# EasyEDA schematic SCH_Beekeeper_2024-03-11.json
TITLE: Beekeeper; REV: 0.3; Date: 2024-01-10; Sheet: 1/1; Company: Your Company
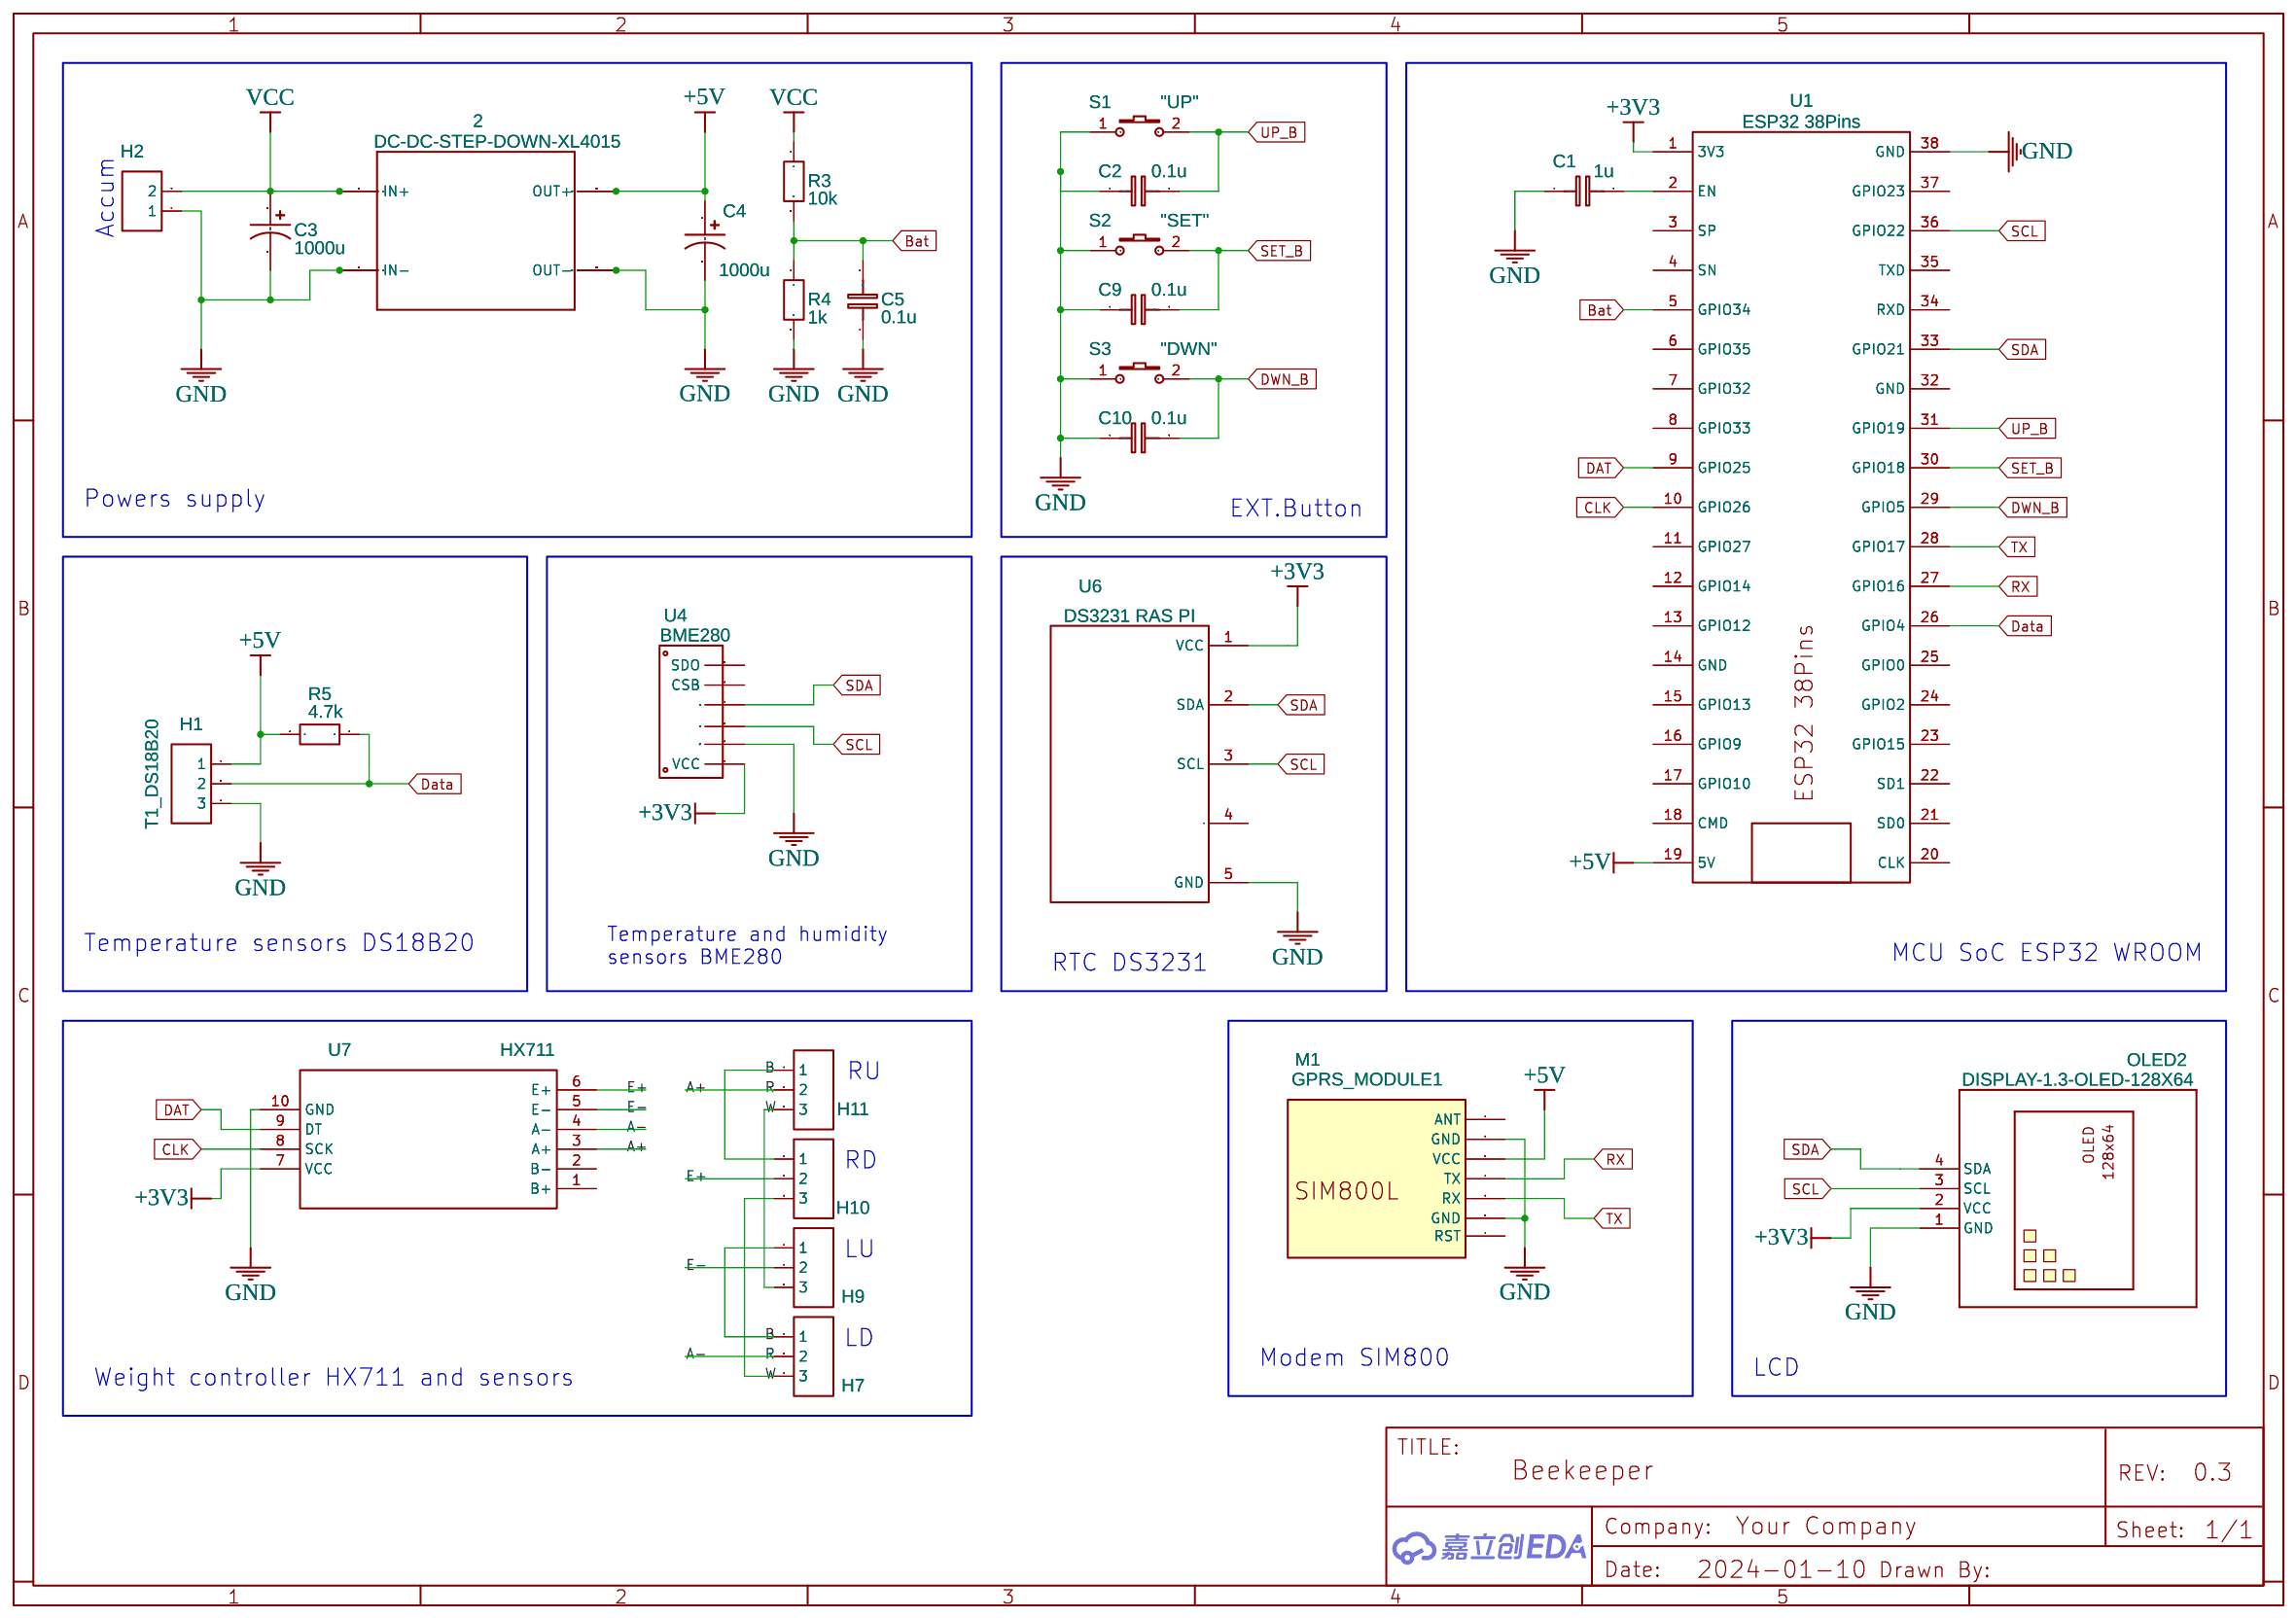
[diagram p0: schematic sheet]

## Parts
2  DC-DC-STEP-DOWN-XL4015  [DC-DC-STEP-DOWN-XL4015]
C1  1u  [C0805]
C2  0.1u  [C0805]
C3  1000u  [CAP-D12.5×F5.0]
C4  1000u  [CAP-D12.5×F5.0]
C5  0.1u  [C0805]
C9  0.1u  [C0805]
C10  0.1u  [C0805]
H1  T1_DS18B20  [HDR-F-2.54_1X3]
H2  HDR-F-2.54_1x2  [HDR-F-2.54_1X2]
H7  HDR-F-2.54_1x3  [HDR-F-2.54_1X3]
H9  HDR-F-2.54_1x3  [HDR-F-2.54_1X3]
H10  HDR-F-2.54_1x3  [HDR-F-2.54_1X3]
H11  HDR-F-2.54_1x3  [HDR-F-2.54_1X3]
M1  GPRS_MODULE1  [SIM800L_MODULE]
OLED2  DISPLAY-1.3-OLED-128X64  [1.3 I2C OLED SSD1306]
R3  10k  [R1206]
R4  1k  [R1206]
R5  4.7k  [R1206]
S1  "UP"  [KEY-SMD_2P-L6.2-W3.6-LS8.0]
S2  "SET"  [KEY-SMD_2P-L6.2-W3.6-LS8.0]
S3  "DWN"  [KEY-SMD_2P-L6.2-W3.6-LS8.0]
U1  ESP32 38Pins  [ESP32 38PINS]
U4  BME280  [BME280]
U6  DS3231 RAS PI  [DS3231_PI]
U7  HX711  [HX711-MODULE]

## Library data of the parts
2 = DC-DC-STEP-DOWN-XL4015: Contributor: Oleg Krava
C1 C2 C5 C9 C10 = C_0805_EU: Contributor: LCEDA_Lib
C3 C4 = CE_TH_D12.5×F5.0_US: Contributor: LCEDA_Lib
H1 H7 H9-H11 = HDR-F-2.54_1x3: Supplier Part: C146690; Supplier: LCSC; Contributor: LCEDA_Lib
H2 = HDR-F-2.54_1x2: Supplier Part: C49661; Supplier: LCSC; Contributor: LCEDA_Lib
M1 = GPRS_MODULE1: Supplier Part: SIM800L EVB; Manufacturer: SIMCOM; Manufacturer Part: SIM800L; Contributor: ManiDeepReddyDPSNDGL
OLED2 = DISPLAY-1.3-OLED-128X64-I2C: Contributor: hdutton
R3-R5 = R_1206_EU: Contributor: LCEDA_Lib
S1-S3 = K2-3.6×6.1_SMD: Supplier Part: C118141; Supplier: LCSC; Manufacturer Part: K2-1107ST-A4SW-06; Contributor: LCEDA_Lib; 制造商: 韩国韩荣
U1 = ESP32 38Pins: Contributor: Amd Cool
U4 = BME280: Contributor: marius4
U6 = DS3231 RAS PI: Manufacturer Part: New SchematicLib; Contributor: rajmqtt
U7 = HX711: Contributor: Shreyansh_D

## Nets
+3V3: OLED2.2(VCC) U1.1(3V3) U4.1(VCC) U6.1(VCC) U7.7(VCC)
+5V: 2.O+(OUT+) 2.OUT+ C4.1 H1.1 M1.3(VCC) R5.2 U1.19(5V)
GND: 2.I-(IN-) 2.IN- 2.O-(OUT-) 2.OUT- C1.1 C2.1 C3.2 C4.2 C5.1 C9.1 C10.1 H1.3 H2.1 M1.2(GND) M1.6(GND) OLED2.1(GND) R4.2 S1.1 S2.1 S3.1 U1.38(GND) U4.2(GND) U6.5(GND) U7.10(GND)
VCC: 2.I+(IN+) 2.IN+ C3.1 H2.2 R3.1
A+: H7.2 H11.2 U7.3(A+) U7.4(A-)
B: H7.1 H9.1 H10.1 H11.1
Bat: C5.2 R3.2 R4.1 U1.5(GPIO34)
CLK: U1.10(GPIO26) U7.8(SCK)
DAT: U1.9(GPIO25) U7.9(DT)
Data: H1.2 R5.1 U1.26(GPIO4)
DWN_B: C10.2 S3.2 U1.29(GPIO5)
E+: H10.2 U7.6(E+)
E-: H9.2 U7.5(E-)
RX: M1.4(TX) U1.27(GPIO16)
SCL: OLED2.3(SCL) U1.36(GPIO22) U4.3(SCL) U6.3(SCL)
SDA: OLED2.4(SDA) U1.33(GPIO21) U4.4(SDA) U6.2(SDA)
SET_B: C9.2 S2.2 U1.30(GPIO18)
TX: M1.5(RX) U1.28(GPIO17)
UP_B: C2.2 S1.2 U1.31(GPIO19)
W: H7.3 H9.3 H10.3 H11.3
Net-(C1-2): C1.2 U1.2(EN)

Not connected (* = marked no-connect by the designer): M1 1(ANT) 7(RST); U1 3(SP) 4(SN) 6(GPIO35) 7(GPIO32) 8(GPIO33) 11(GPIO27) 12(GPIO14) 13(GPIO12) 14(GND) 15(GPIO13) 16(GPIO9) 17(GPIO10) 18(CMD) 20(CLK) 21(SD0) 22(SD1) 23(GPIO15) 24(GPIO2) 25(GPIO0) 32(GND) 34(RXD) 35(TXD) 37(GPIO23); U4 5(CSB) 6(SDO); U6 4; U7 1(B+) 2(B-)

## Notes on the sheet
- Accum
- Powers supply
- EXT.Button
- Temperature sensors DS18B20
- Temperature and humidity
  sensors BME280
- RTC DS3231
- MCU SoC ESP32 WROOM
- RU
- RD
- LU
- LD
- Modem SIM800
- Weight controller HX711 and sensors
- LCD
